# Altium schematic sheet LEDMulti.SchDoc
size Tabloid
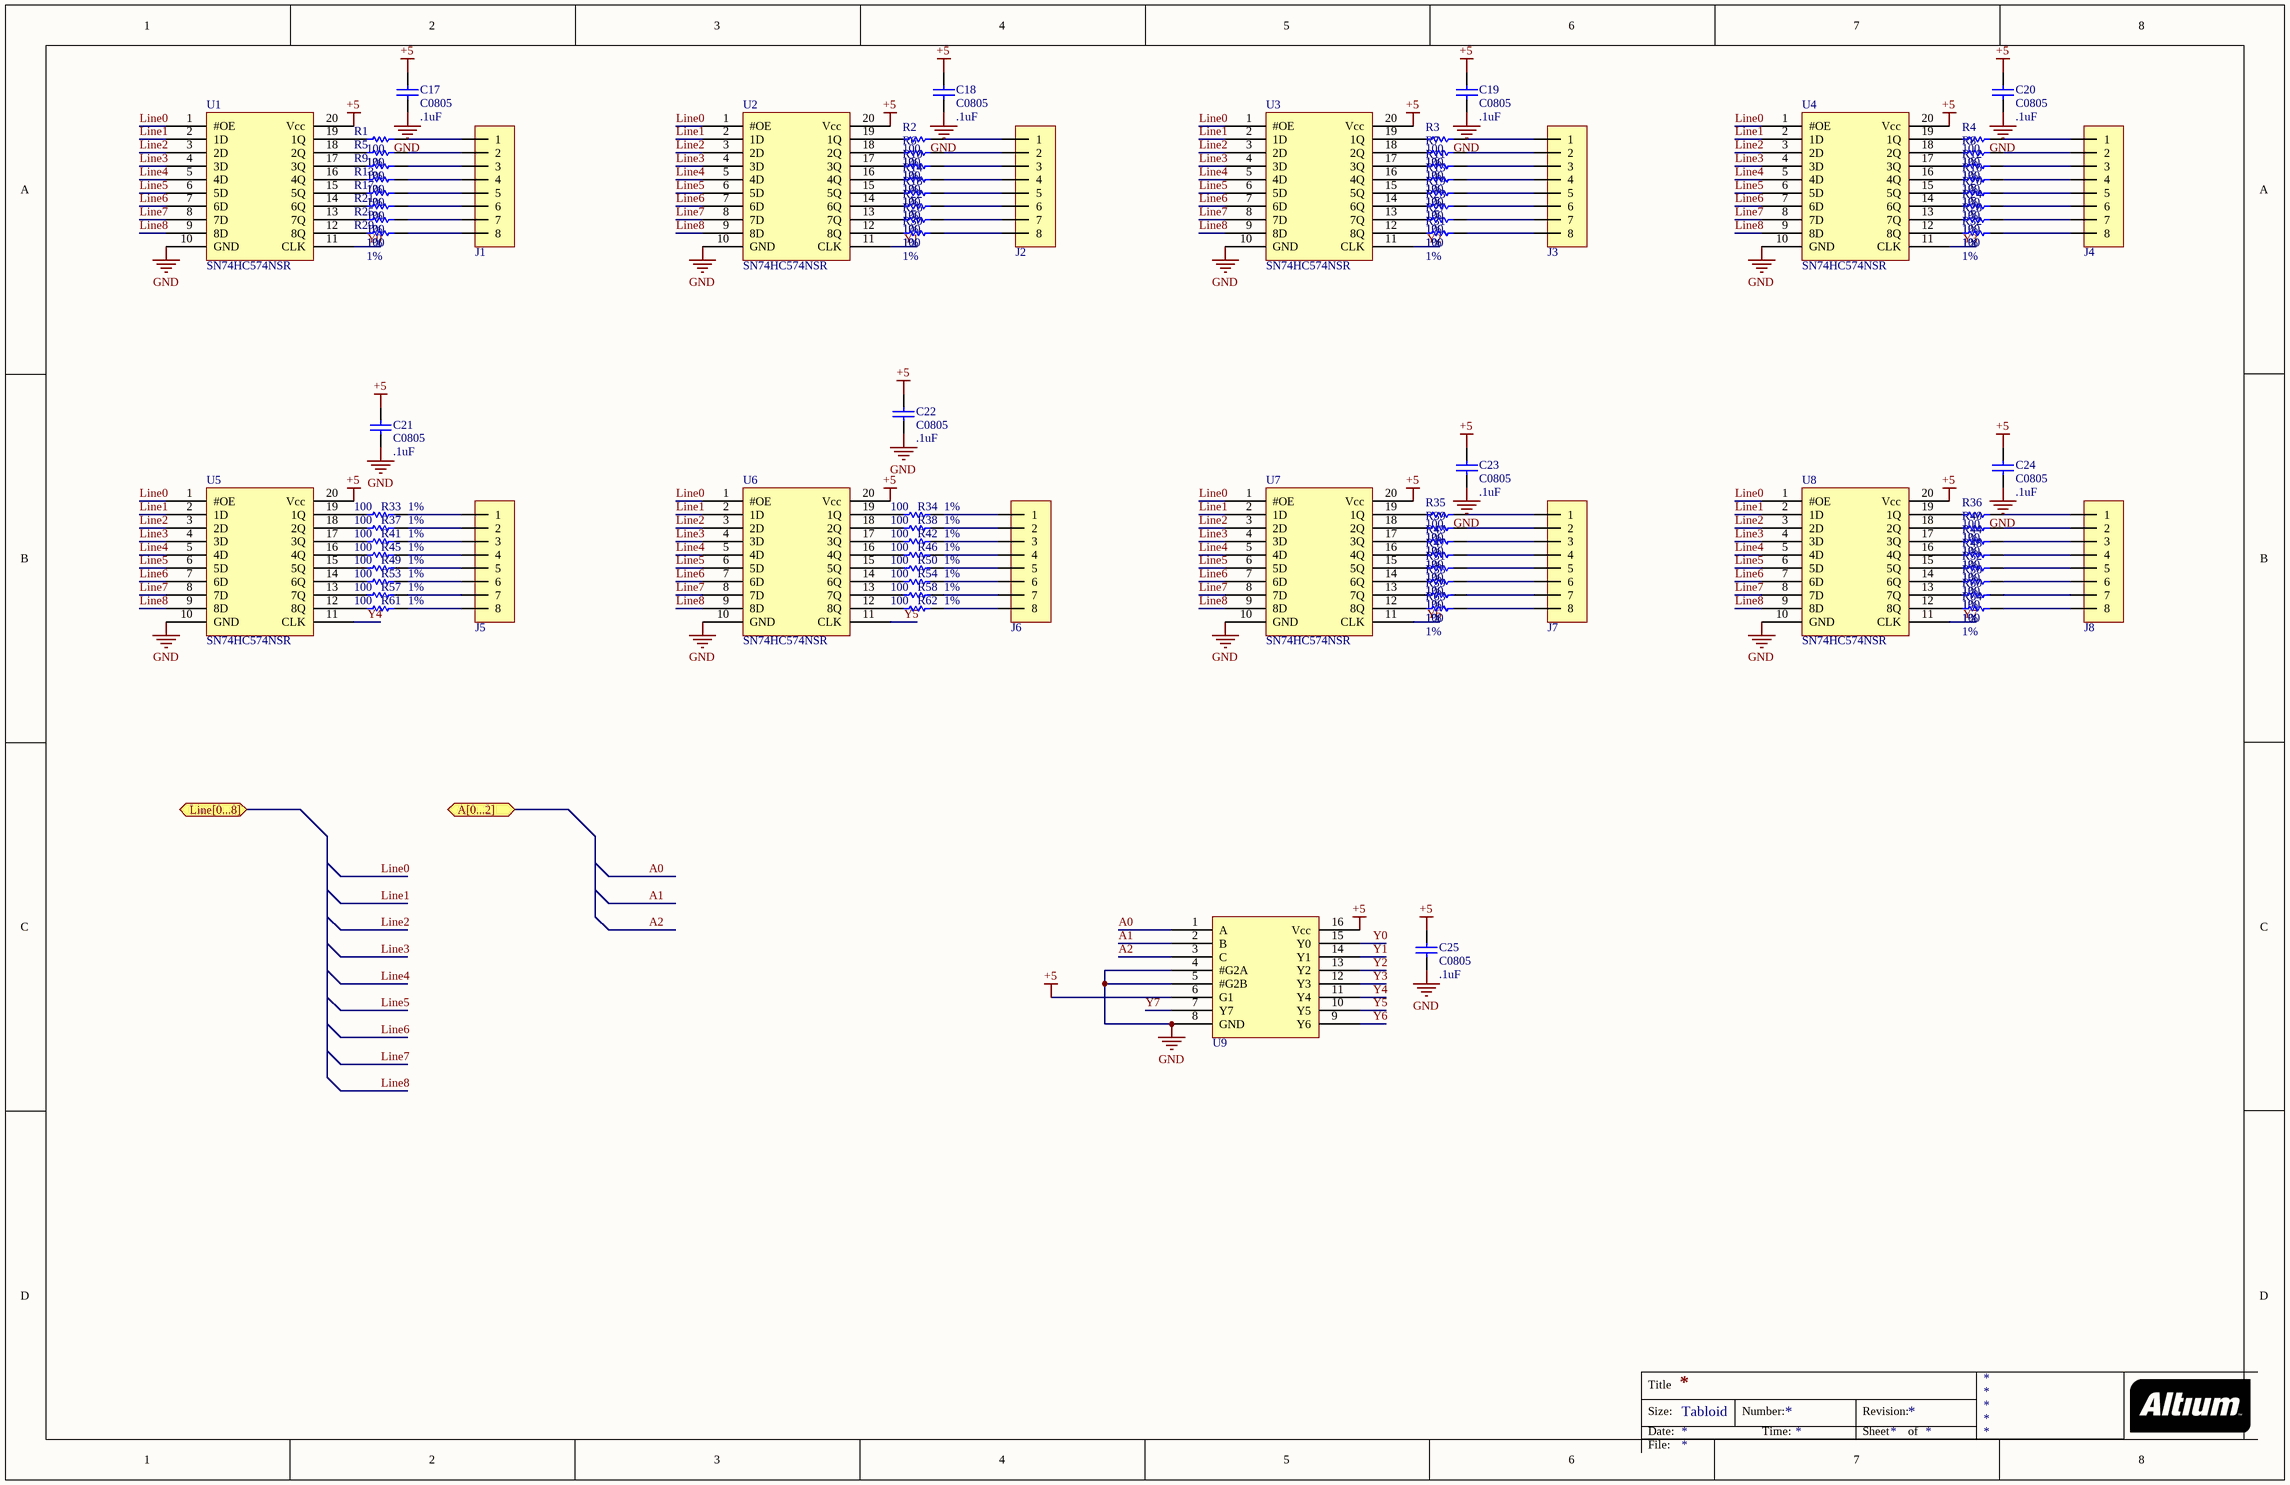
[diagram p0: LEDMulti.SchDoc]

## Parts
C17  C0805  value .1uF  [0805]
C18  C0805  value .1uF  [0805]
C19  C0805  value .1uF  [0805]
C20  C0805  value .1uF  [0805]
C21  C0805  value .1uF  [0805]
C22  C0805  value .1uF  [0805]
C23  C0805  value .1uF  [0805]
C24  C0805  value .1uF  [0805]
C25  C0805  value .1uF  [0805]
J1  8x1 Male Header Pin  [Male 8x1]  (value not drawn)
J2  8x1 Male Header Pin  [Male 8x1]  (value not drawn)
J3  8x1 Male Header Pin  [Male 8x1]  (value not drawn)
J4  8x1 Male Header Pin  [Male 8x1]  (value not drawn)
J5  8x1 Male Header Pin  [Male 8x1]  (value not drawn)
J6  8x1 Male Header Pin  [Male 8x1]  (value not drawn)
J7  8x1 Male Header Pin  [Male 8x1]  (value not drawn)
J8  8x1 Male Header Pin  [Male 8x1]  (value not drawn)
R1  Tolerance: 1%  [R 0805 (2012) RESISTOR]  (hidden comment: 100)
R2  Tolerance: 1%  [R 0805 (2012) RESISTOR]  (hidden comment: 100)
R3  Tolerance: 1%  [R 0805 (2012) RESISTOR]  (hidden comment: 100)
R4  Tolerance: 1%  [R 0805 (2012) RESISTOR]  (hidden comment: 100)
R5  Tolerance: 1%  [R 0805 (2012) RESISTOR]  (hidden comment: 100)
R6  Tolerance: 1%  [R 0805 (2012) RESISTOR]  (hidden comment: 100)
R7  Tolerance: 1%  [R 0805 (2012) RESISTOR]  (hidden comment: 100)
R8  Tolerance: 1%  [R 0805 (2012) RESISTOR]  (hidden comment: 100)
R9  Tolerance: 1%  [R 0805 (2012) RESISTOR]  (hidden comment: 100)
R10  Tolerance: 1%  [R 0805 (2012) RESISTOR]  (hidden comment: 100)
R11  Tolerance: 1%  [R 0805 (2012) RESISTOR]  (hidden comment: 100)
R12  Tolerance: 1%  [R 0805 (2012) RESISTOR]  (hidden comment: 100)
R13  Tolerance: 1%  [R 0805 (2012) RESISTOR]  (hidden comment: 100)
R14  Tolerance: 1%  [R 0805 (2012) RESISTOR]  (hidden comment: 100)
R15  Tolerance: 1%  [R 0805 (2012) RESISTOR]  (hidden comment: 100)
R16  Tolerance: 1%  [R 0805 (2012) RESISTOR]  (hidden comment: 100)
R17  Tolerance: 1%  [R 0805 (2012) RESISTOR]  (hidden comment: 100)
R18  Tolerance: 1%  [R 0805 (2012) RESISTOR]  (hidden comment: 100)
R19  Tolerance: 1%  [R 0805 (2012) RESISTOR]  (hidden comment: 100)
R20  Tolerance: 1%  [R 0805 (2012) RESISTOR]  (hidden comment: 100)
R21  Tolerance: 1%  [R 0805 (2012) RESISTOR]  (hidden comment: 100)
R22  Tolerance: 1%  [R 0805 (2012) RESISTOR]  (hidden comment: 100)
R23  Tolerance: 1%  [R 0805 (2012) RESISTOR]  (hidden comment: 100)
R24  Tolerance: 1%  [R 0805 (2012) RESISTOR]  (hidden comment: 100)
R25  Tolerance: 1%  [R 0805 (2012) RESISTOR]  (hidden comment: 100)
R26  Tolerance: 1%  [R 0805 (2012) RESISTOR]  (hidden comment: 100)
R27  Tolerance: 1%  [R 0805 (2012) RESISTOR]  (hidden comment: 100)
R28  Tolerance: 1%  [R 0805 (2012) RESISTOR]  (hidden comment: 100)
R29  Tolerance: 1%  [R 0805 (2012) RESISTOR]  (hidden comment: 100)
R30  Tolerance: 1%  [R 0805 (2012) RESISTOR]  (hidden comment: 100)
R31  Tolerance: 1%  [R 0805 (2012) RESISTOR]  (hidden comment: 100)
R32  Tolerance: 1%  [R 0805 (2012) RESISTOR]  (hidden comment: 100)
R33  Tolerance: 1%  [R 0805 (2012) RESISTOR]  (hidden comment: 100)
R34  Tolerance: 1%  [R 0805 (2012) RESISTOR]  (hidden comment: 100)
R35  Tolerance: 1%  [R 0805 (2012) RESISTOR]  (hidden comment: 100)
R36  Tolerance: 1%  [R 0805 (2012) RESISTOR]  (hidden comment: 100)
R37  Tolerance: 1%  [R 0805 (2012) RESISTOR]  (hidden comment: 100)
R38  Tolerance: 1%  [R 0805 (2012) RESISTOR]  (hidden comment: 100)
R39  Tolerance: 1%  [R 0805 (2012) RESISTOR]  (hidden comment: 100)
R40  Tolerance: 1%  [R 0805 (2012) RESISTOR]  (hidden comment: 100)
R41  Tolerance: 1%  [R 0805 (2012) RESISTOR]  (hidden comment: 100)
R42  Tolerance: 1%  [R 0805 (2012) RESISTOR]  (hidden comment: 100)
R43  Tolerance: 1%  [R 0805 (2012) RESISTOR]  (hidden comment: 100)
R44  Tolerance: 1%  [R 0805 (2012) RESISTOR]  (hidden comment: 100)
R45  Tolerance: 1%  [R 0805 (2012) RESISTOR]  (hidden comment: 100)
R46  Tolerance: 1%  [R 0805 (2012) RESISTOR]  (hidden comment: 100)
R47  Tolerance: 1%  [R 0805 (2012) RESISTOR]  (hidden comment: 100)
R48  Tolerance: 1%  [R 0805 (2012) RESISTOR]  (hidden comment: 100)
R49  Tolerance: 1%  [R 0805 (2012) RESISTOR]  (hidden comment: 100)
R50  Tolerance: 1%  [R 0805 (2012) RESISTOR]  (hidden comment: 100)
R51  Tolerance: 1%  [R 0805 (2012) RESISTOR]  (hidden comment: 100)
R52  Tolerance: 1%  [R 0805 (2012) RESISTOR]  (hidden comment: 100)
R53  Tolerance: 1%  [R 0805 (2012) RESISTOR]  (hidden comment: 100)
R54  Tolerance: 1%  [R 0805 (2012) RESISTOR]  (hidden comment: 100)
R55  Tolerance: 1%  [R 0805 (2012) RESISTOR]  (hidden comment: 100)
R56  Tolerance: 1%  [R 0805 (2012) RESISTOR]  (hidden comment: 100)
R57  Tolerance: 1%  [R 0805 (2012) RESISTOR]  (hidden comment: 100)
R58  Tolerance: 1%  [R 0805 (2012) RESISTOR]  (hidden comment: 100)
R59  Tolerance: 1%  [R 0805 (2012) RESISTOR]  (hidden comment: 100)
R60  Tolerance: 1%  [R 0805 (2012) RESISTOR]  (hidden comment: 100)
R61  Tolerance: 1%  [R 0805 (2012) RESISTOR]  (hidden comment: 100)
R62  Tolerance: 1%  [R 0805 (2012) RESISTOR]  (hidden comment: 100)
R63  Tolerance: 1%  [R 0805 (2012) RESISTOR]  (hidden comment: 100)
R64  Tolerance: 1%  [R 0805 (2012) RESISTOR]  (hidden comment: 100)
U1  SN74HC574NSR  [TSSOP 20]
U2  SN74HC574NSR  [TSSOP 20]
U3  SN74HC574NSR  [TSSOP 20]
U4  SN74HC574NSR  [TSSOP 20]
U5  SN74HC574NSR  [TSSOP 20]
U6  SN74HC574NSR  [TSSOP 20]
U7  SN74HC574NSR  [TSSOP 20]
U8  SN74HC574NSR  [TSSOP 20]
U9  SN74HC138N  [SOP16]  (value not drawn)

## Ports
A[0...2], Line[0...8]

## Nets
+5: C17.2 C18.2 C19.2 C20.2 C21.2 C22.2 C23.2 C24.2 C25.2 U1.20(Vcc) U2.20(Vcc) U3.20(Vcc) U4.20(Vcc) U5.20(Vcc) U6.20(Vcc) U7.20(Vcc) U8.20(Vcc) U9.6(G1) U9.16(Vcc)
GND: C17.1 C18.1 C19.1 C20.1 C21.1 C22.1 C23.1 C24.1 C25.1 U1.10(GND) U2.10(GND) U3.10(GND) U4.10(GND) U5.10(GND) U6.10(GND) U7.10(GND) U8.10(GND) U9.4(#G2A) U9.5(#G2B) U9.8(GND)
A0: U9.1(A)
A1: U9.2(B)
A2: U9.3(C)
Line0: U1.1(#OE) U2.1(#OE) U3.1(#OE) U4.1(#OE) U5.1(#OE) U6.1(#OE) U7.1(#OE) U8.1(#OE)
Line1: U1.2(1D) U2.2(1D) U3.2(1D) U4.2(1D) U5.2(1D) U6.2(1D) U7.2(1D) U8.2(1D)
Line2: U1.3(2D) U2.3(2D) U3.3(2D) U4.3(2D) U5.3(2D) U6.3(2D) U7.3(2D) U8.3(2D)
Line3: U1.4(3D) U2.4(3D) U3.4(3D) U4.4(3D) U5.4(3D) U6.4(3D) U7.4(3D) U8.4(3D)
Line4: U1.5(4D) U2.5(4D) U3.5(4D) U4.5(4D) U5.5(4D) U6.5(4D) U7.5(4D) U8.5(4D)
Line5: U1.6(5D) U2.6(5D) U3.6(5D) U4.6(5D) U5.6(5D) U6.6(5D) U7.6(5D) U8.6(5D)
Line6: U1.7(6D) U2.7(6D) U3.7(6D) U4.7(6D) U5.7(6D) U6.7(6D) U7.7(6D) U8.7(6D)
Line7: U1.8(7D) U2.8(7D) U3.8(7D) U4.8(7D) U5.8(7D) U6.8(7D) U7.8(7D) U8.8(7D)
Line8: U1.9(8D) U2.9(8D) U3.9(8D) U4.9(8D) U5.9(8D) U6.9(8D) U7.9(8D) U8.9(8D)
Y0: U1.11(CLK) U9.15(Y0)
Y1: U2.11(CLK) U9.14(Y1)
Y2: U3.11(CLK) U9.13(Y2)
Y3: U4.11(CLK) U9.12(Y3)
Y4: U5.11(CLK) U9.11(Y4)
Y5: U6.11(CLK) U9.10(Y5)
Y6: U7.11(CLK) U9.9(Y6)
Y7: U8.11(CLK) U9.7(Y7)
NetJ1_1: J1.1 R1.2
NetJ1_2: J1.2 R5.2
NetJ1_3: J1.3 R9.2
NetJ1_4: J1.4 R13.2
NetJ1_5: J1.5 R17.2
NetJ1_6: J1.6 R21.2
NetJ1_7: J1.7 R25.2
NetJ1_8: J1.8 R29.2
NetJ2_1: J2.1 R2.2
NetJ2_2: J2.2 R6.2
NetJ2_3: J2.3 R10.2
NetJ2_4: J2.4 R14.2
NetJ2_5: J2.5 R18.2
NetJ2_6: J2.6 R22.2
NetJ2_7: J2.7 R26.2
NetJ2_8: J2.8 R30.2
NetJ3_1: J3.1 R3.2
NetJ3_2: J3.2 R7.2
NetJ3_3: J3.3 R11.2
NetJ3_4: J3.4 R15.2
NetJ3_5: J3.5 R19.2
NetJ3_6: J3.6 R23.2
NetJ3_7: J3.7 R27.2
NetJ3_8: J3.8 R31.2
NetJ4_1: J4.1 R4.2
NetJ4_2: J4.2 R8.2
NetJ4_3: J4.3 R12.2
NetJ4_4: J4.4 R16.2
NetJ4_5: J4.5 R20.2
NetJ4_6: J4.6 R24.2
NetJ4_7: J4.7 R28.2
NetJ4_8: J4.8 R32.2
NetJ5_1: J5.1 R33.2
NetJ5_2: J5.2 R37.2
NetJ5_3: J5.3 R41.2
NetJ5_4: J5.4 R45.2
NetJ5_5: J5.5 R49.2
NetJ5_6: J5.6 R53.2
NetJ5_7: J5.7 R57.2
NetJ5_8: J5.8 R61.2
NetJ6_1: J6.1 R34.2
NetJ6_2: J6.2 R38.2
NetJ6_3: J6.3 R42.2
NetJ6_4: J6.4 R46.2
NetJ6_5: J6.5 R50.2
NetJ6_6: J6.6 R54.2
NetJ6_7: J6.7 R58.2
NetJ6_8: J6.8 R62.2
NetJ7_1: J7.1 R35.2
NetJ7_2: J7.2 R39.2
NetJ7_3: J7.3 R43.2
NetJ7_4: J7.4 R47.2
NetJ7_5: J7.5 R51.2
NetJ7_6: J7.6 R55.2
NetJ7_7: J7.7 R59.2
NetJ7_8: J7.8 R63.2
NetJ8_1: J8.1 R36.2
NetJ8_2: J8.2 R40.2
NetJ8_3: J8.3 R44.2
NetJ8_4: J8.4 R48.2
NetJ8_5: J8.5 R52.2
NetJ8_6: J8.6 R56.2
NetJ8_7: J8.7 R60.2
NetJ8_8: J8.8 R64.2
NetR1_1: R1.1 U1.19(1Q)
NetR2_1: R2.1 U2.19(1Q)
NetR3_1: R3.1 U3.19(1Q)
NetR4_1: R4.1 U4.19(1Q)
NetR5_1: R5.1 U1.18(2Q)
NetR6_1: R6.1 U2.18(2Q)
NetR7_1: R7.1 U3.18(2Q)
NetR8_1: R8.1 U4.18(2Q)
NetR9_1: R9.1 U1.17(3Q)
NetR10_1: R10.1 U2.17(3Q)
NetR11_1: R11.1 U3.17(3Q)
NetR12_1: R12.1 U4.17(3Q)
NetR13_1: R13.1 U1.16(4Q)
NetR14_1: R14.1 U2.16(4Q)
NetR15_1: R15.1 U3.16(4Q)
NetR16_1: R16.1 U4.16(4Q)
NetR17_1: R17.1 U1.15(5Q)
NetR18_1: R18.1 U2.15(5Q)
NetR19_1: R19.1 U3.15(5Q)
NetR20_1: R20.1 U4.15(5Q)
NetR21_1: R21.1 U1.14(6Q)
NetR22_1: R22.1 U2.14(6Q)
NetR23_1: R23.1 U3.14(6Q)
NetR24_1: R24.1 U4.14(6Q)
NetR25_1: R25.1 U1.13(7Q)
NetR26_1: R26.1 U2.13(7Q)
NetR27_1: R27.1 U3.13(7Q)
NetR28_1: R28.1 U4.13(7Q)
NetR29_1: R29.1 U1.12(8Q)
NetR30_1: R30.1 U2.12(8Q)
NetR31_1: R31.1 U3.12(8Q)
NetR32_1: R32.1 U4.12(8Q)
NetR33_1: R33.1 U5.19(1Q)
NetR34_1: R34.1 U6.19(1Q)
NetR35_1: R35.1 U7.19(1Q)
NetR36_1: R36.1 U8.19(1Q)
NetR37_1: R37.1 U5.18(2Q)
NetR38_1: R38.1 U6.18(2Q)
NetR39_1: R39.1 U7.18(2Q)
NetR40_1: R40.1 U8.18(2Q)
NetR41_1: R41.1 U5.17(3Q)
NetR42_1: R42.1 U6.17(3Q)
NetR43_1: R43.1 U7.17(3Q)
NetR44_1: R44.1 U8.17(3Q)
NetR45_1: R45.1 U5.16(4Q)
NetR46_1: R46.1 U6.16(4Q)
NetR47_1: R47.1 U7.16(4Q)
NetR48_1: R48.1 U8.16(4Q)
NetR49_1: R49.1 U5.15(5Q)
NetR50_1: R50.1 U6.15(5Q)
NetR51_1: R51.1 U7.15(5Q)
NetR52_1: R52.1 U8.15(5Q)
NetR53_1: R53.1 U5.14(6Q)
NetR54_1: R54.1 U6.14(6Q)
NetR55_1: R55.1 U7.14(6Q)
NetR56_1: R56.1 U8.14(6Q)
NetR57_1: R57.1 U5.13(7Q)
NetR58_1: R58.1 U6.13(7Q)
NetR59_1: R59.1 U7.13(7Q)
NetR60_1: R60.1 U8.13(7Q)
NetR61_1: R61.1 U5.12(8Q)
NetR62_1: R62.1 U6.12(8Q)
NetR63_1: R63.1 U7.12(8Q)
NetR64_1: R64.1 U8.12(8Q)

## Notes on the sheet
- Title
- Size:
- Date:
- Tabloid
- Number:
- Time:
- Revision:
- Sheet
- of
- File:

## Library data of the parts
C17-C25 = C0805: Ceramic Chip Capacitor - Standard; Note: Footprint corresponds to dimensions for bulk cassette packaging. This case size has tightened tolerances.; Published: 17-Jul-2002; LatestRevisionDate: 19-Mar-2004; LatestRevisionNote: Silkscreen size reduced.; DatasheetDocument: Mar-2001; PackageDocument: Mar-2001; PackageReference: 0805; Publisher: Altium Limited; Code_JEITA: 0805; Code_IPC: 2012[0805]; ComponentLink1Description: Manufacturer Link; ComponentLink1URL: http://www.kemet.com/; ComponentLink2Description: Datasheet; ComponentLink2URL: http://www.kemet.com/kemet/web/homepage/kechome.nsf/vapubfilesname/F3102TA.pdf/$file/F3102TA.pdf
J1-J8 = 8x1 Male Header Pin: 8x1 100mil Header
R1-R64 = RES 0805 1K 1%: Value: 100
U1-U8 = SN74HC574NSR: IC D-TYPE POS TRG SNGL 20SO
U9 = SN4HC138N: IC DECODER/DEMUX 3-8 LINE 16SO